# Altium schematic sheet 03_PWR.SchDoc
size A4; SheetNumber: 4; SheetTotal: 5
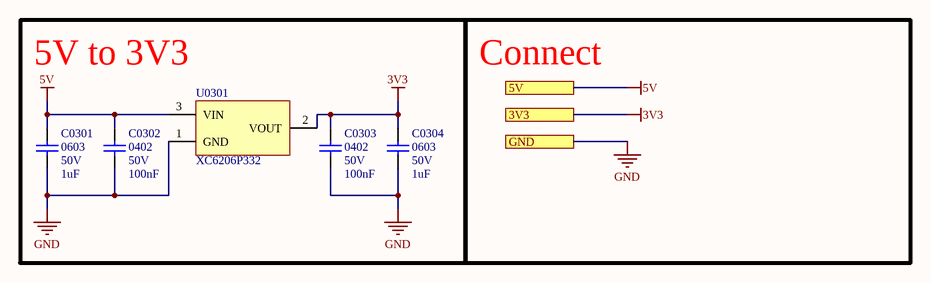
[diagram p0: 03_PWR.SchDoc]

## Parts
C0301  Size: 0603  Volt: 50V  Cap: 1uF  [C0603]  (hidden comment: Cap)
C0302  Size: 0402  Volt: 50V  Cap: 100nF  [C0402]  (hidden comment: Cap)
C0303  Size: 0402  Volt: 50V  Cap: 100nF  [C0402]  (hidden comment: Cap)
C0304  Size: 0603  Volt: 50V  Cap: 1uF  [C0603]  (hidden comment: Cap)
U0301  XC6206P332  [SOT23-3L]

## Blocks framed on the sheet
5V to 3V3: C0301 C0302 C0303 C0304 U0301

## Ports
3V3 (see 00_McuComBrd[3A]), 5V (see 00_McuComBrd[3A]), GND (see 00_McuComBrd[3A])

## Nets
3V3: C0303.2 C0304.2 U0301.2(VOUT) ; port 3V3
5V: C0301.2 C0302.2 U0301.3(VIN) ; port 5V
GND: C0301.1 C0302.1 C0303.1 C0304.1 U0301.1(GND) ; port GND

## Notes on the sheet
- Connect

## Library data of the parts
U0301 = XC6206: VIN < 6V